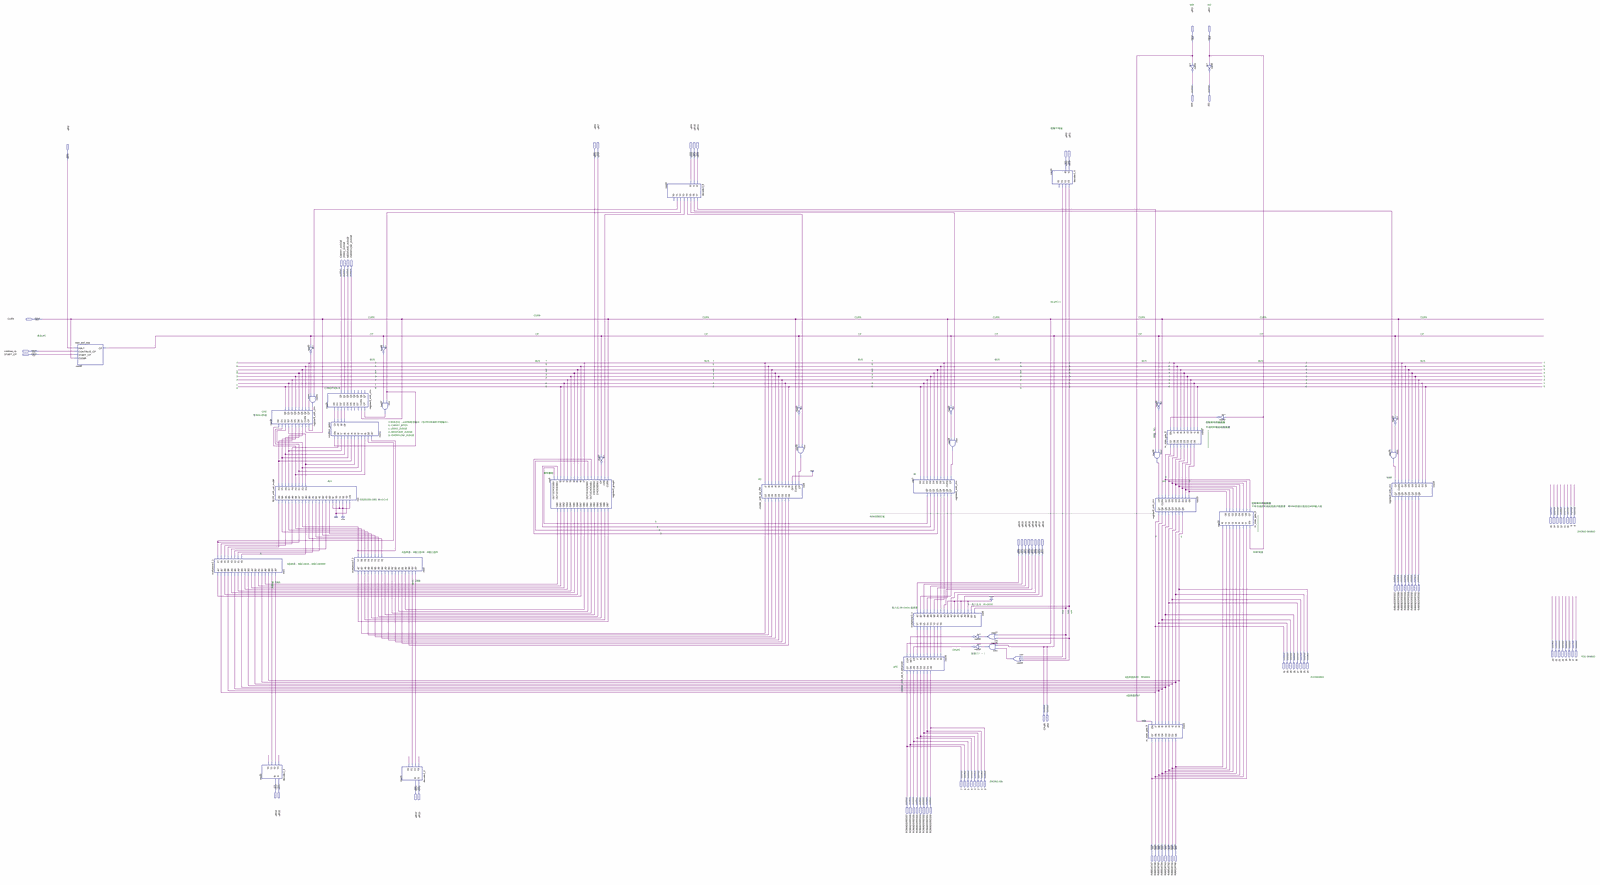
[diagram p0: schematic sheet, whole]
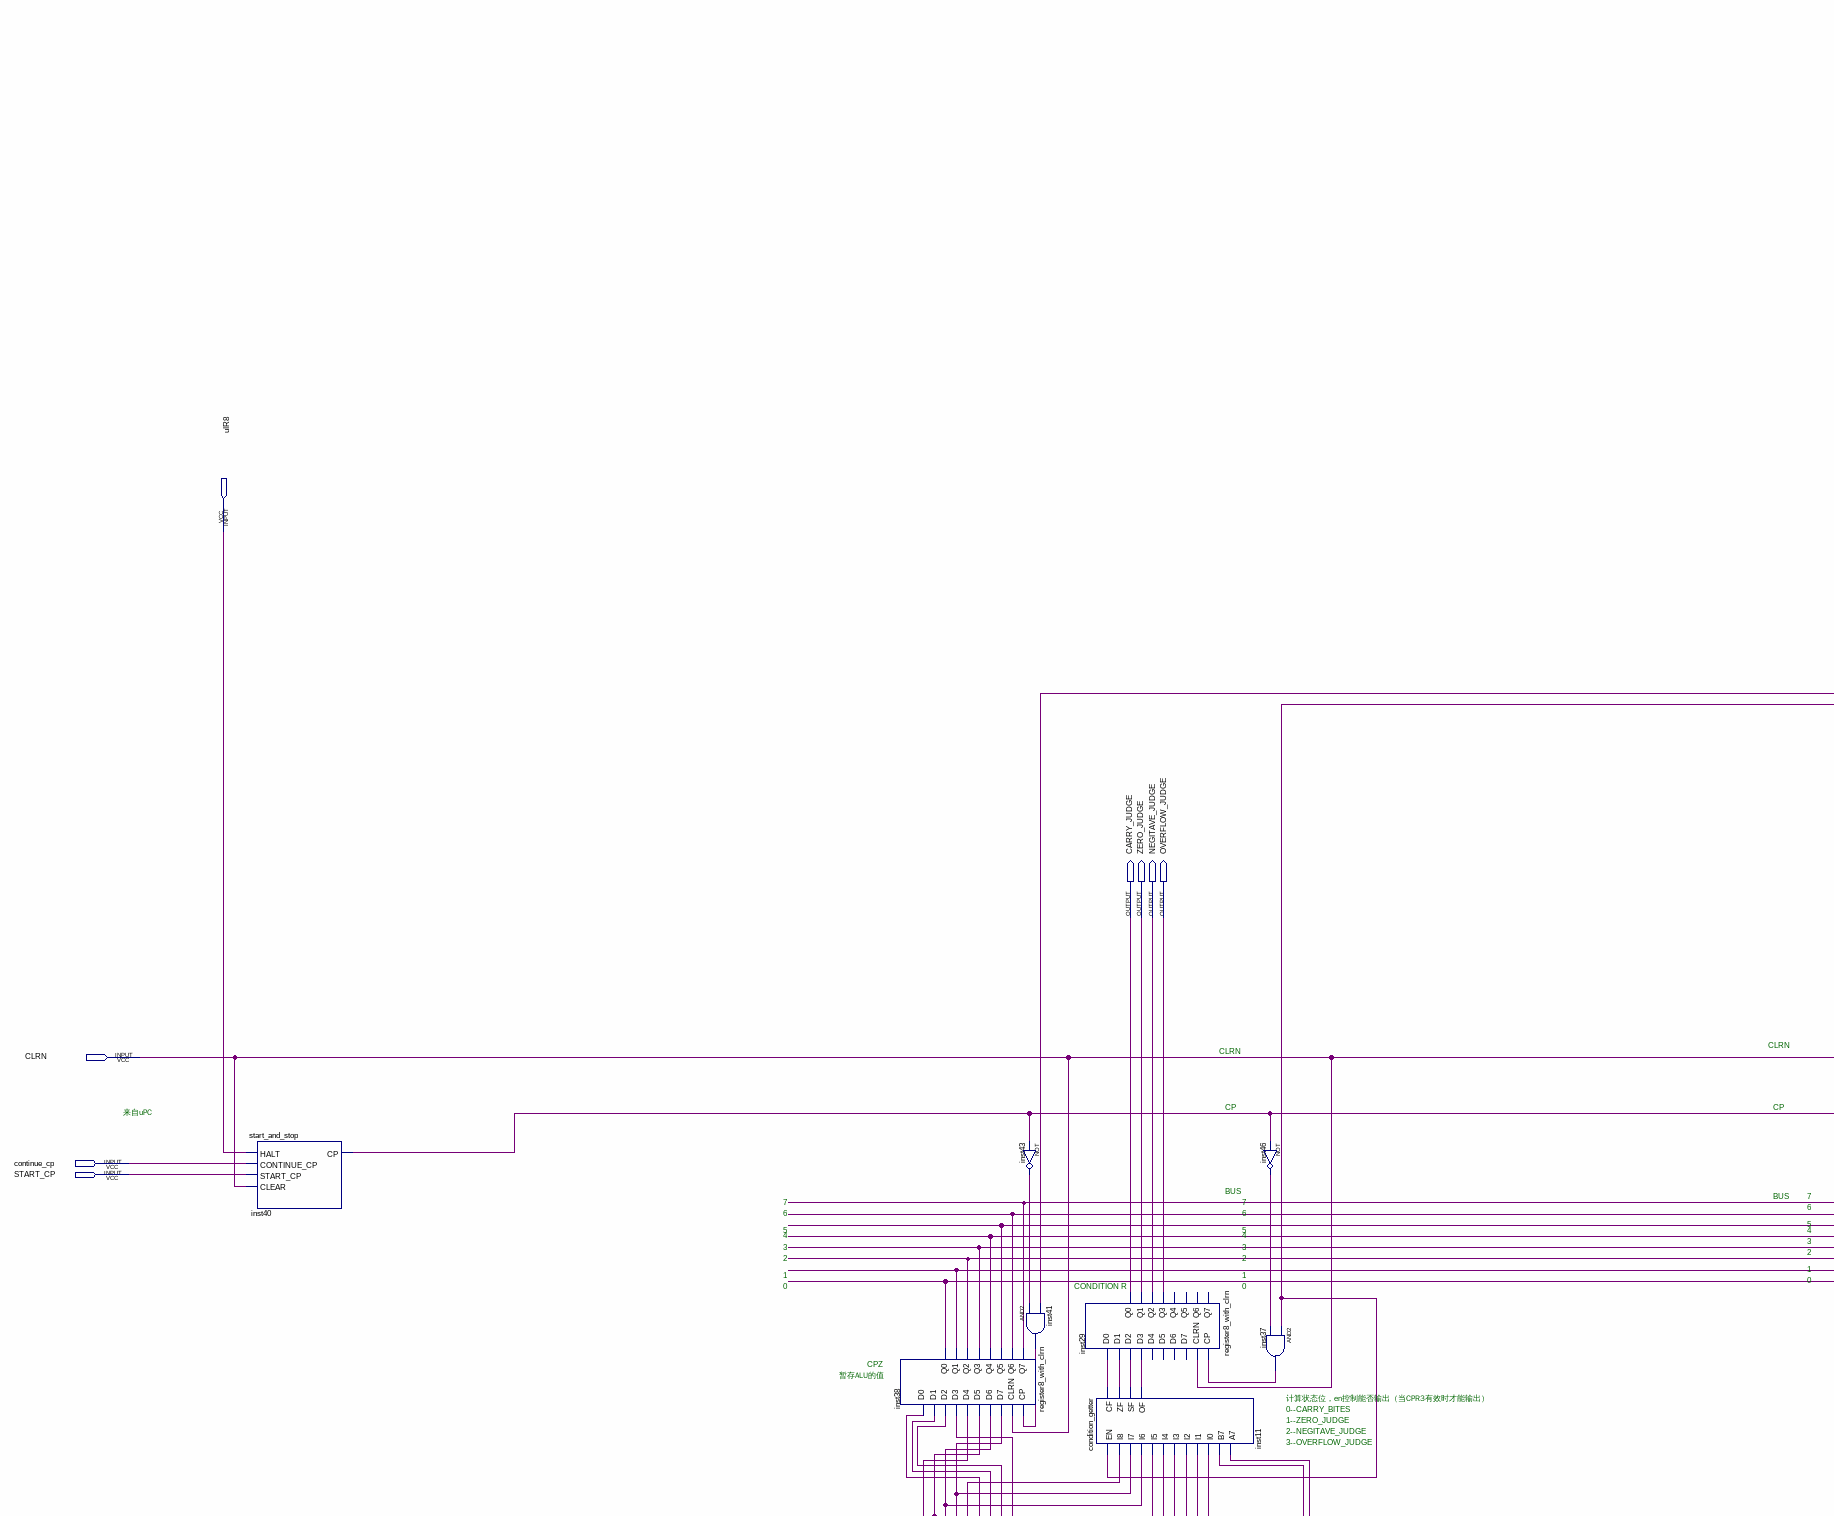
[diagram p1: schematic sheet, upper left part]
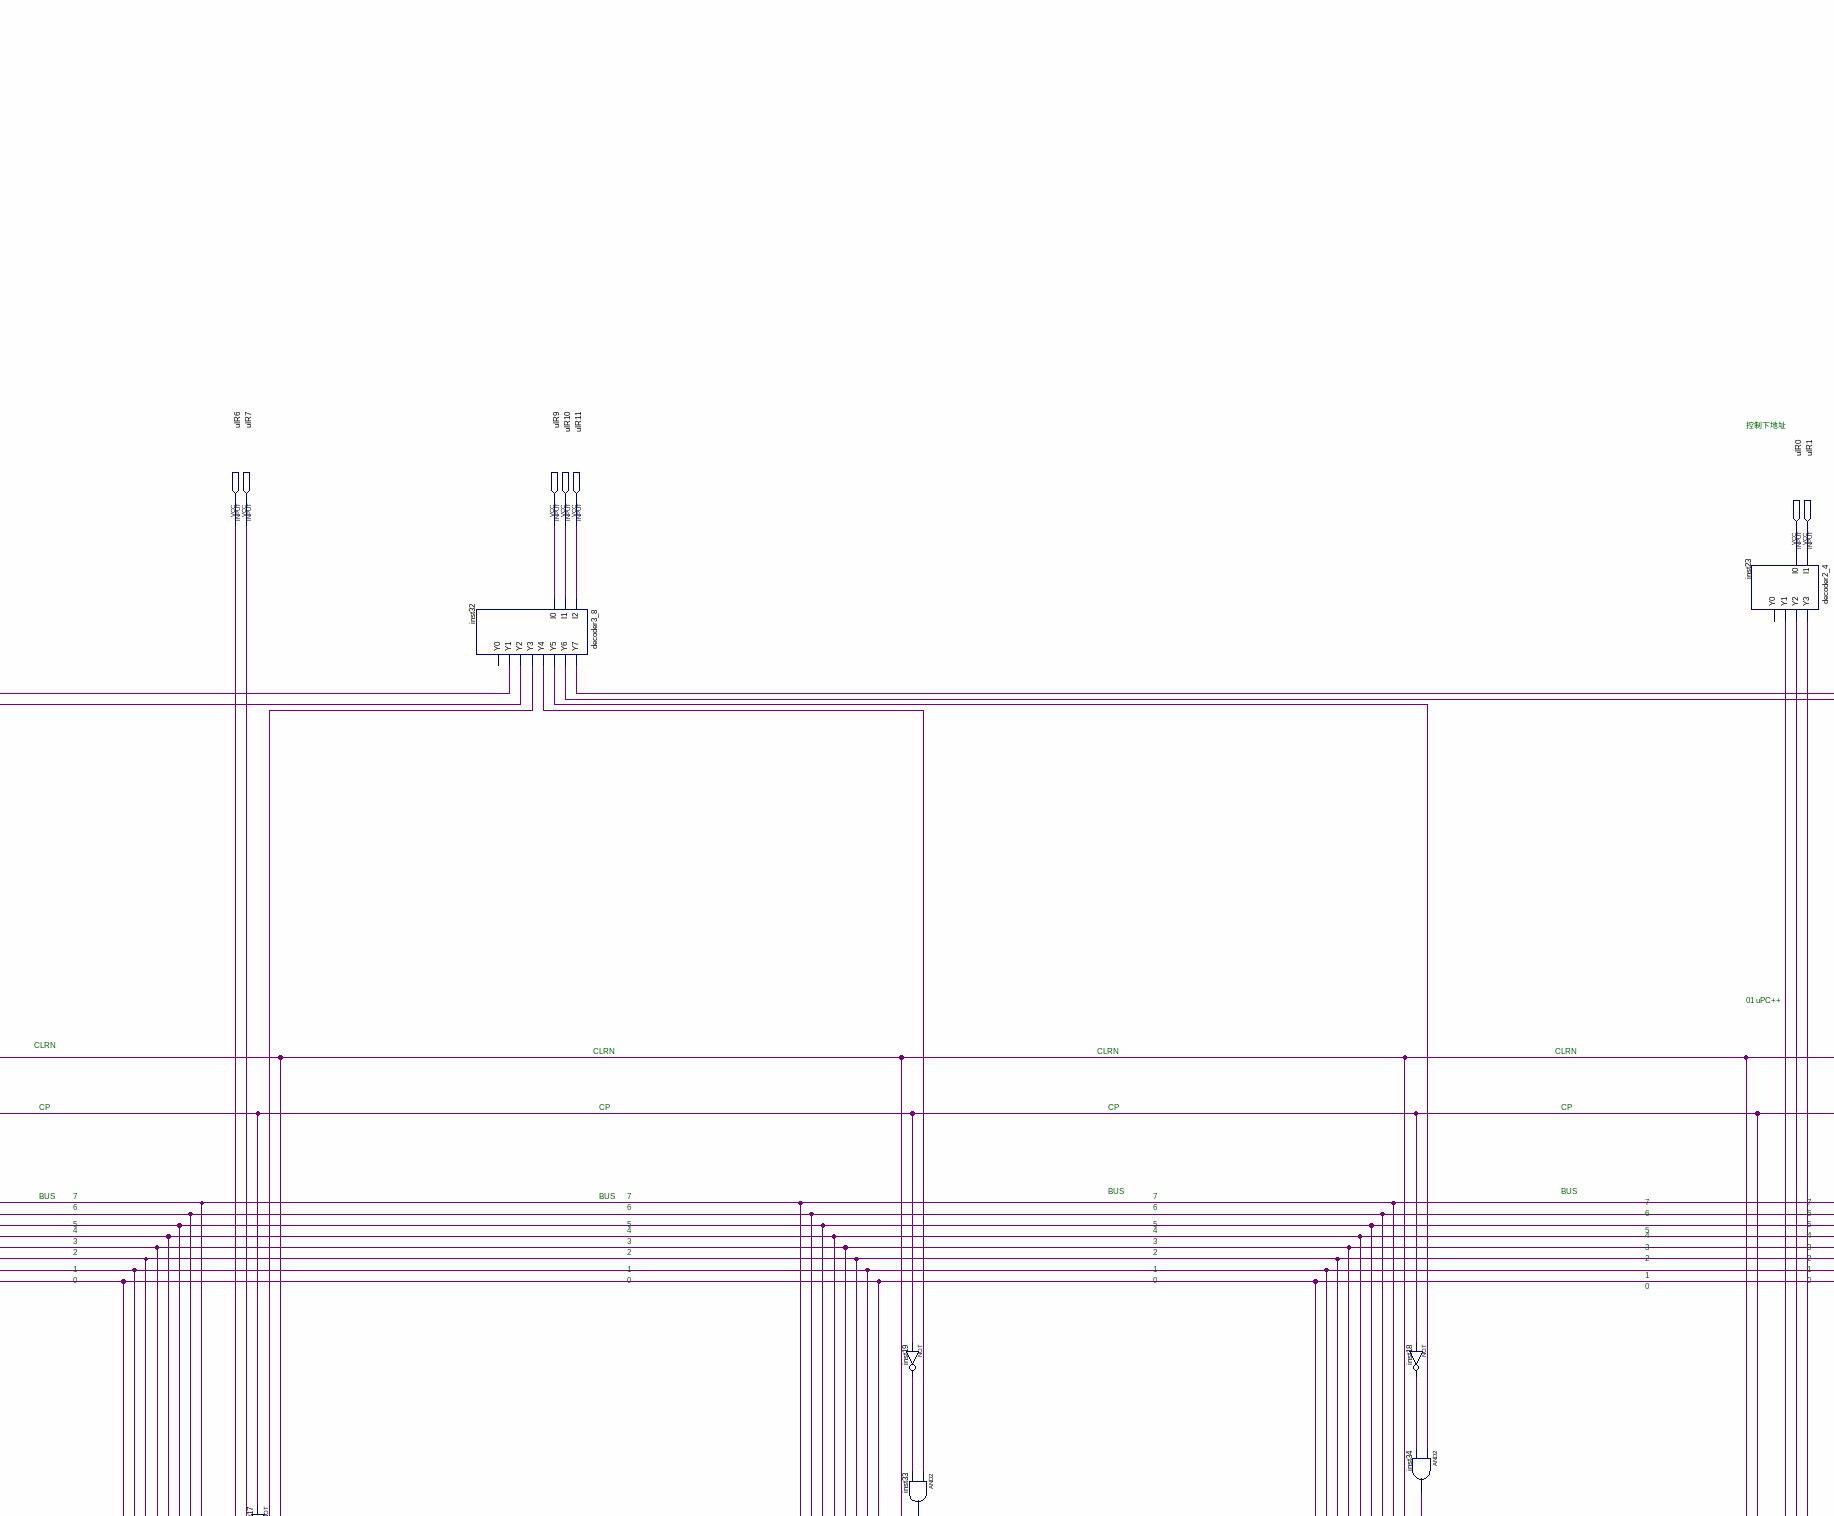
[diagram p2: schematic sheet, upper centre part]
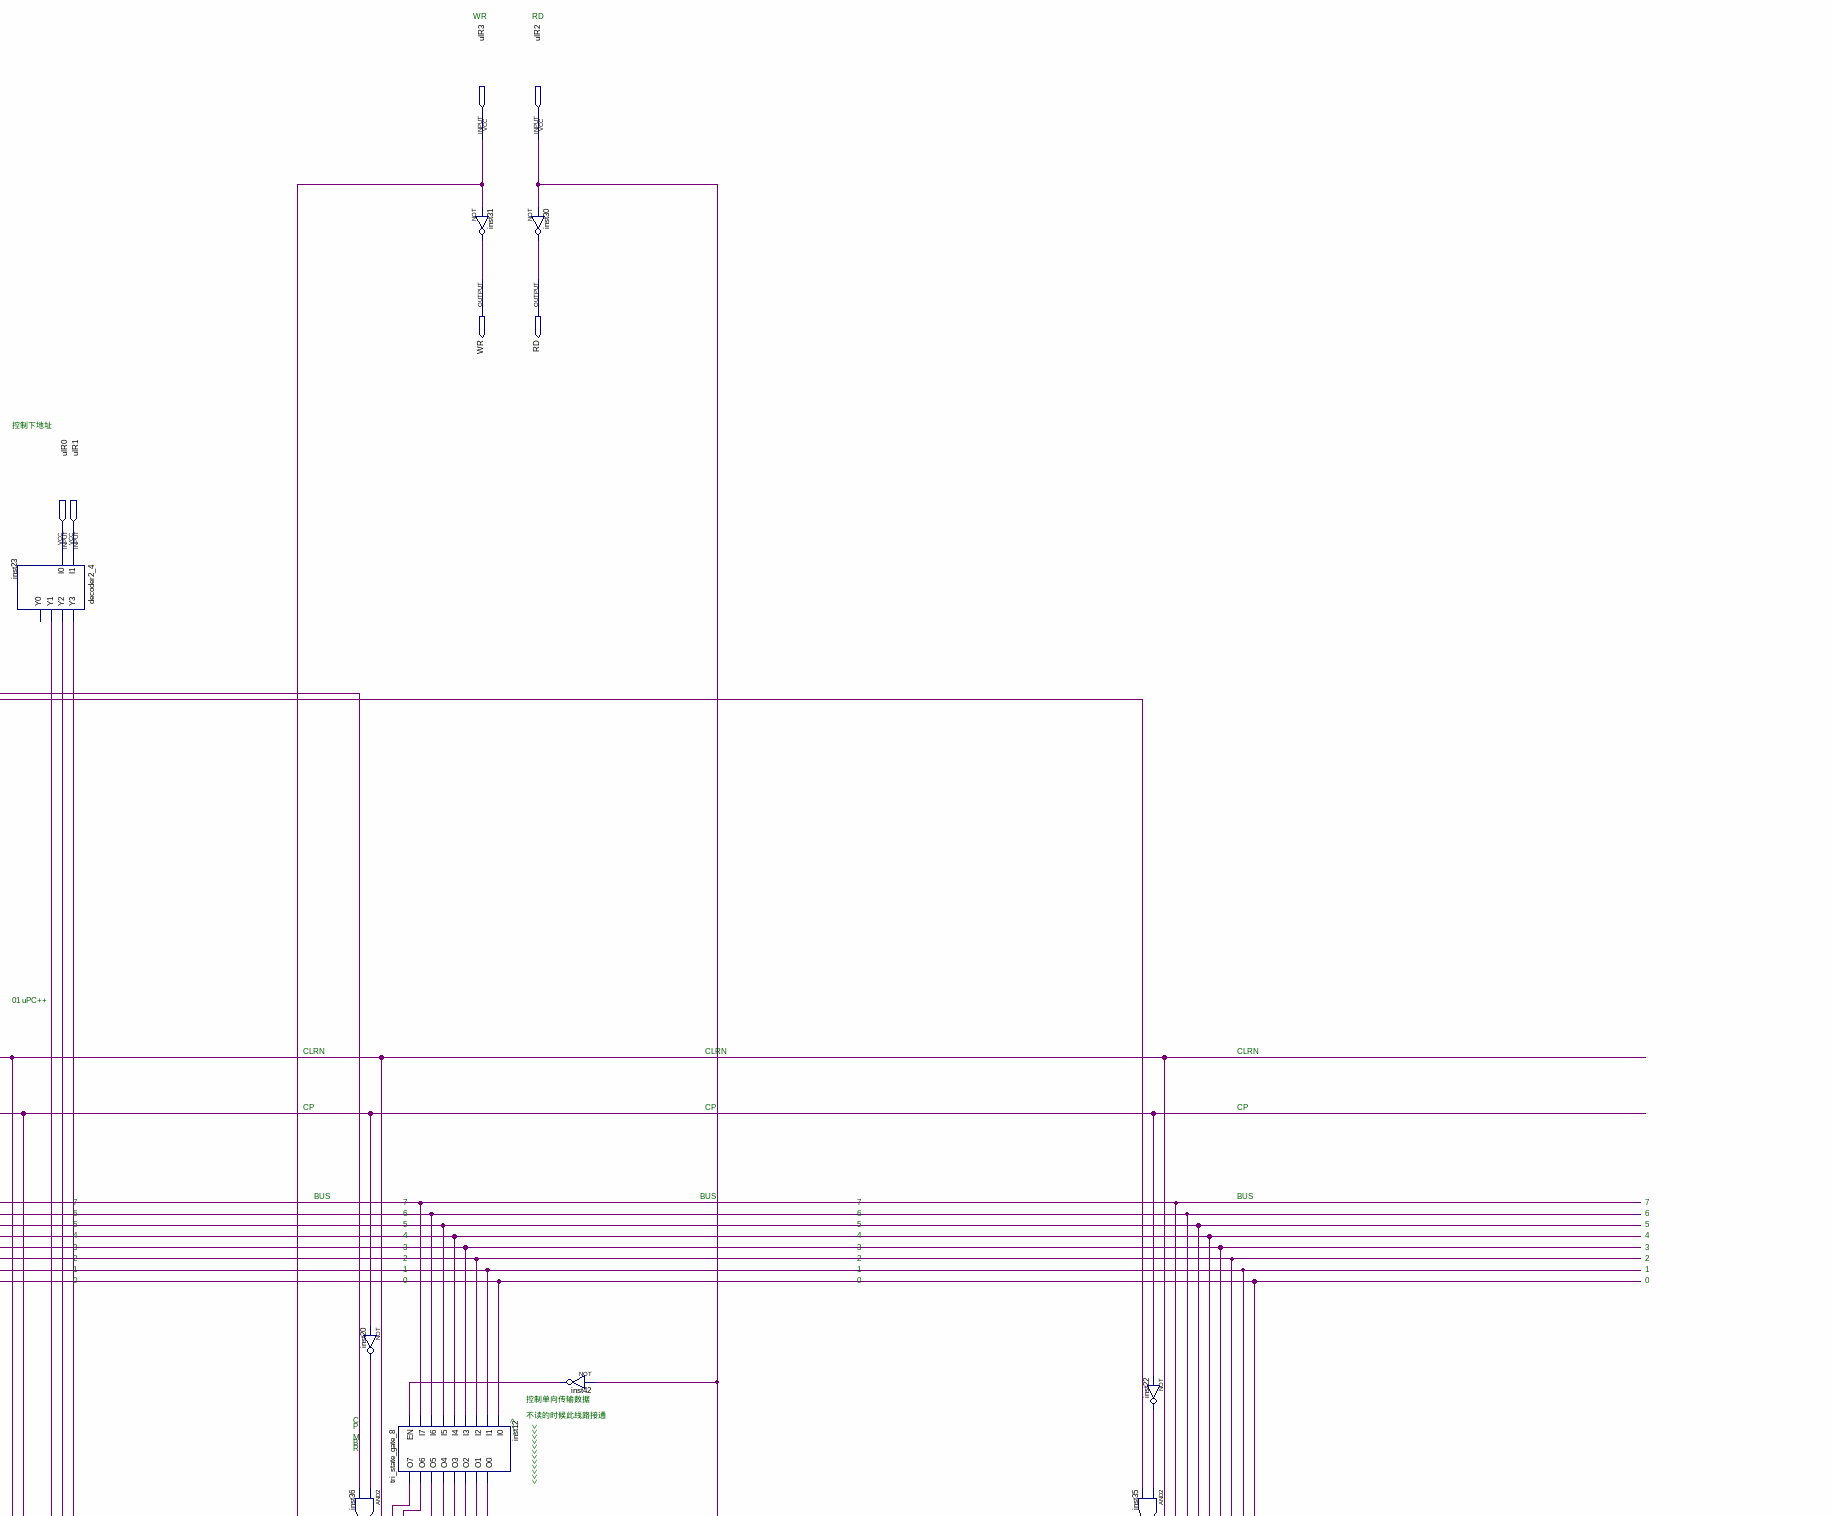
[diagram p3: schematic sheet, upper right part]
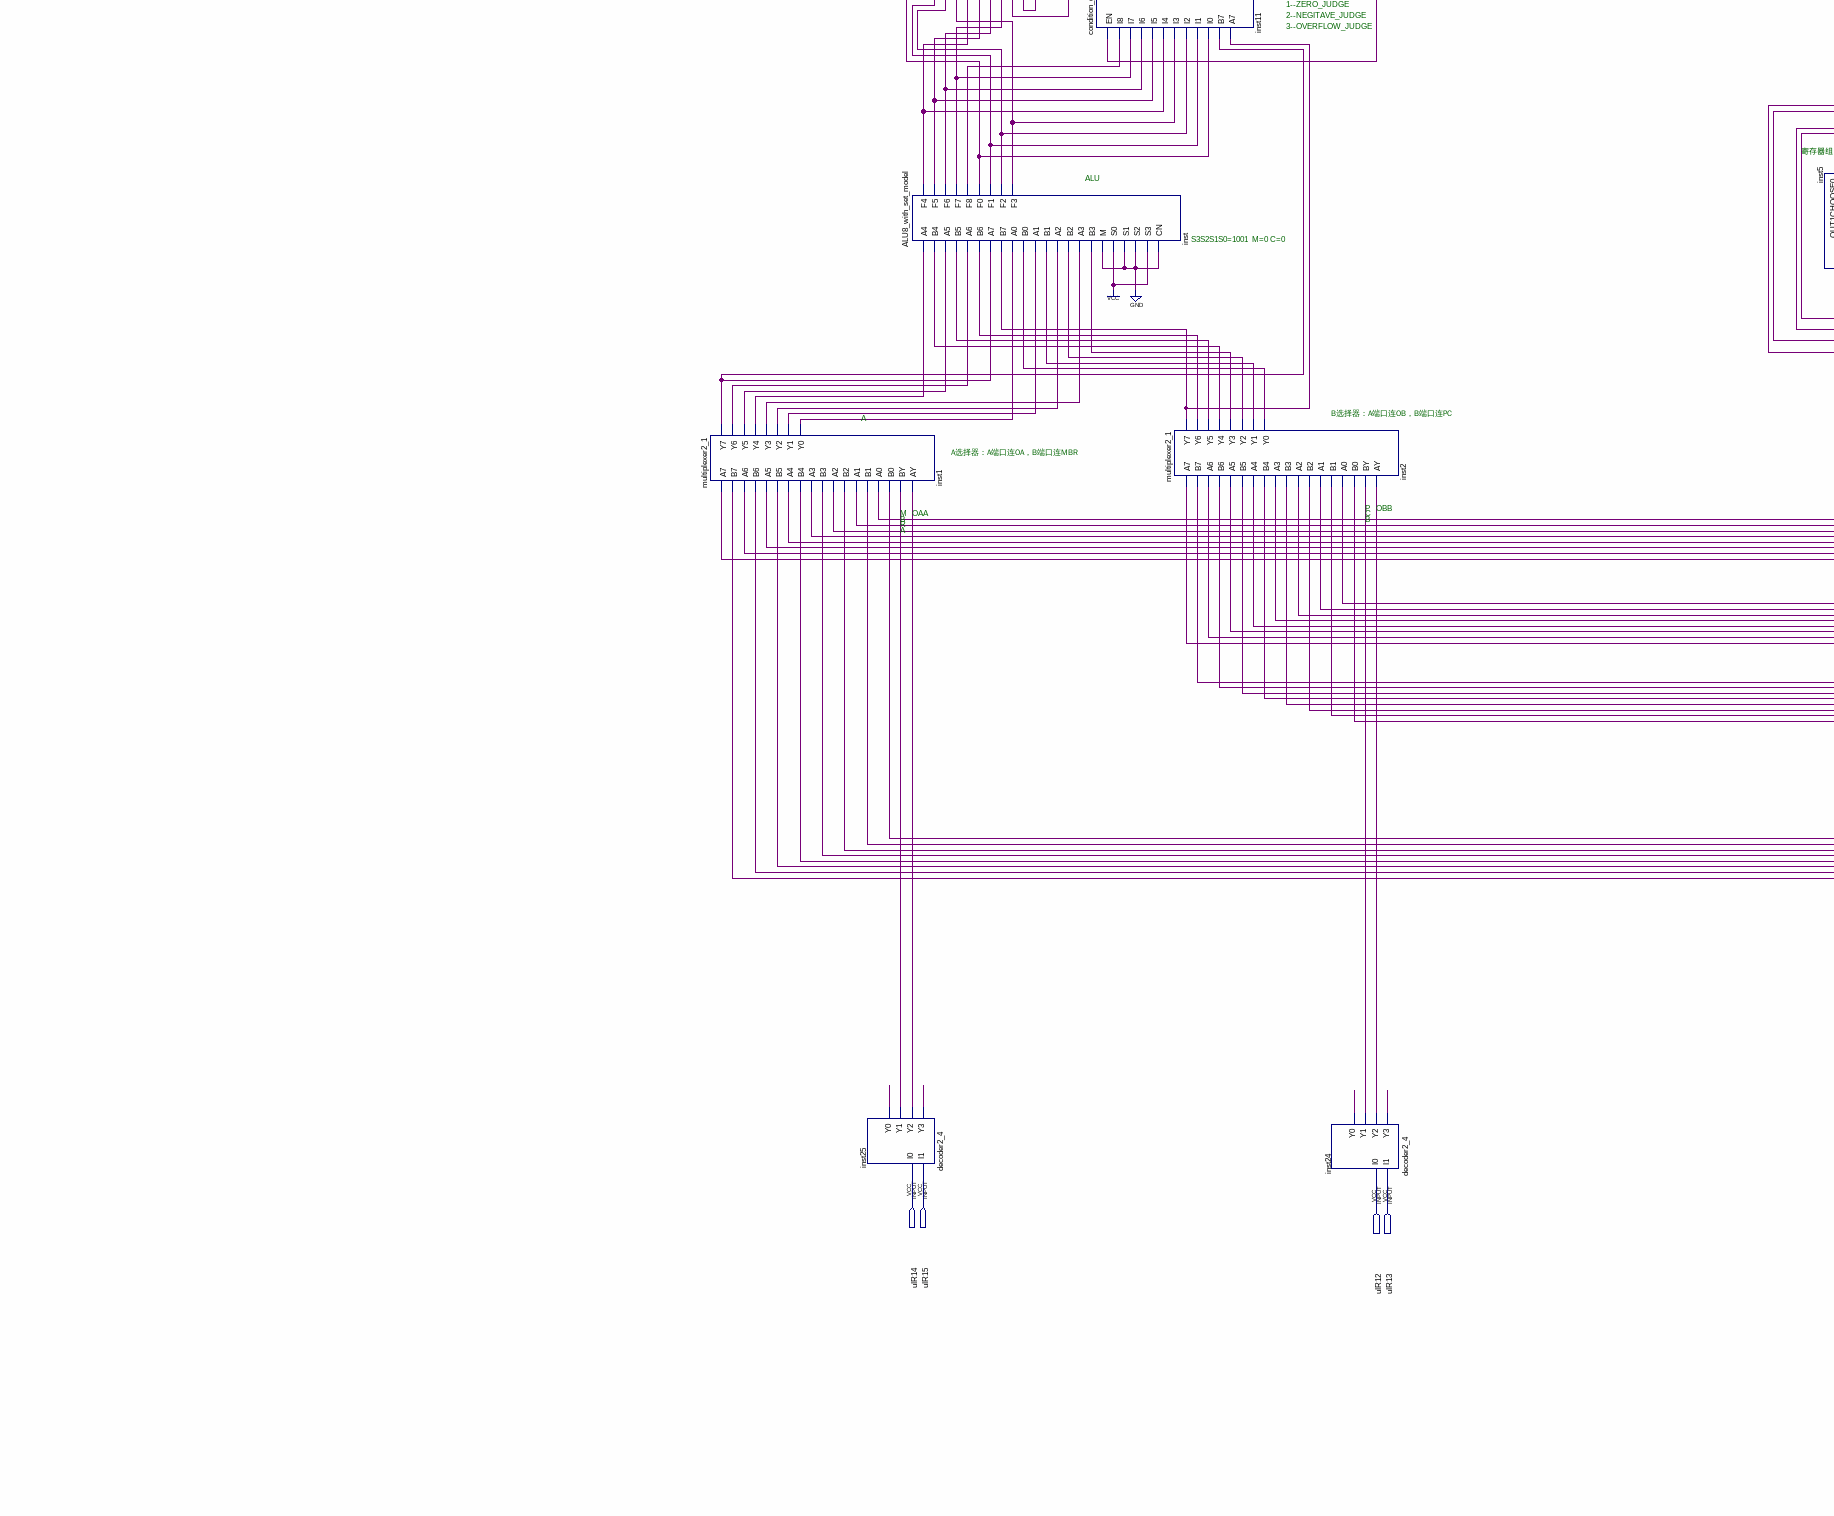
[diagram p4: schematic sheet, lower left part]
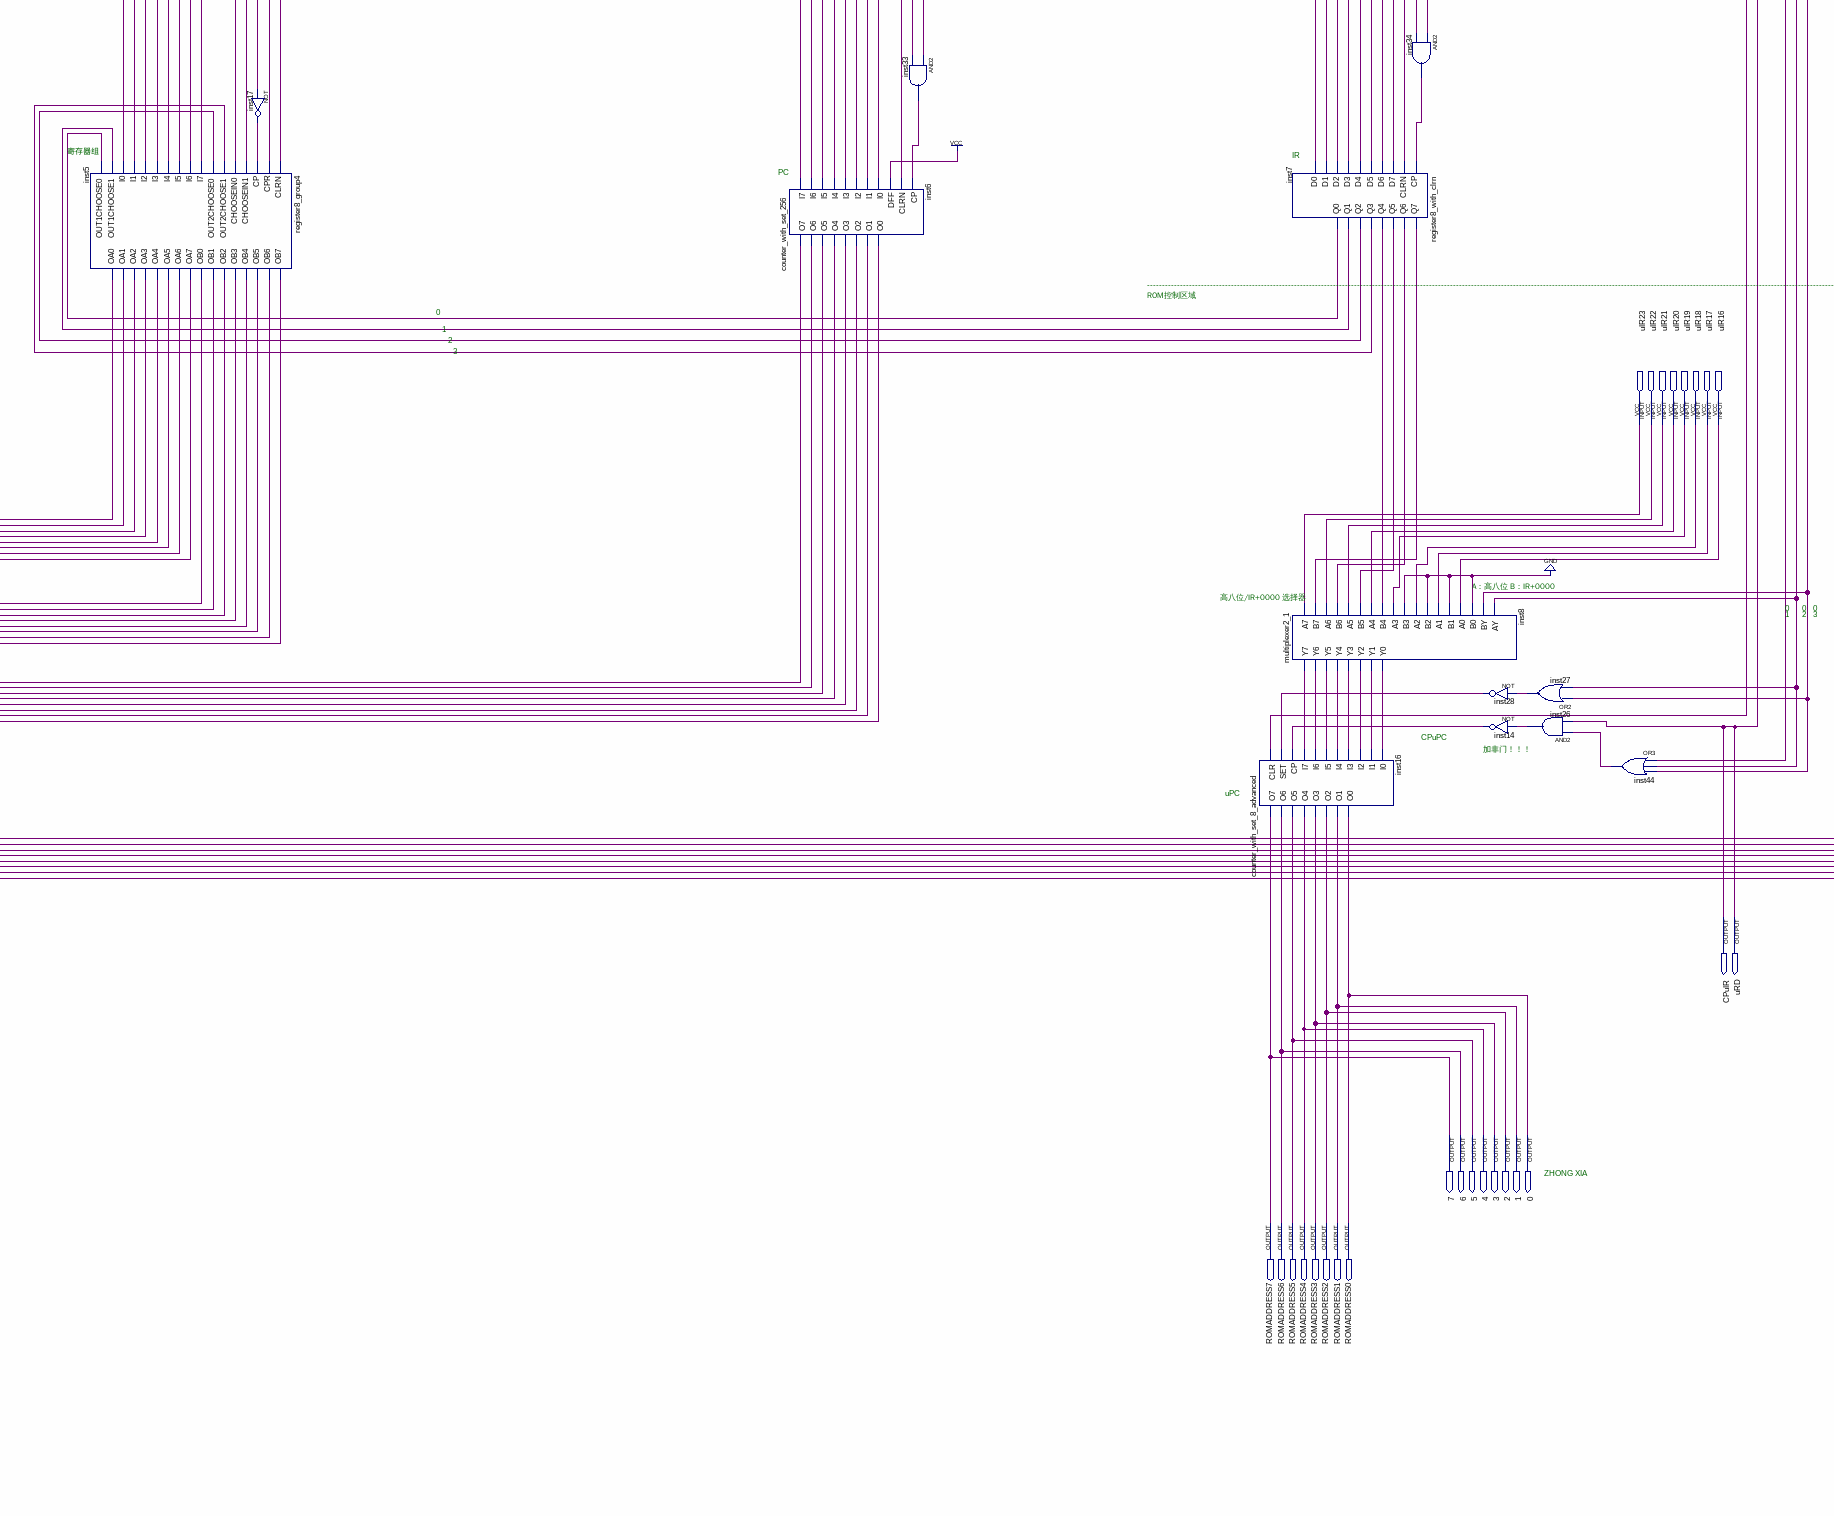
[diagram p5: schematic sheet, lower centre part]
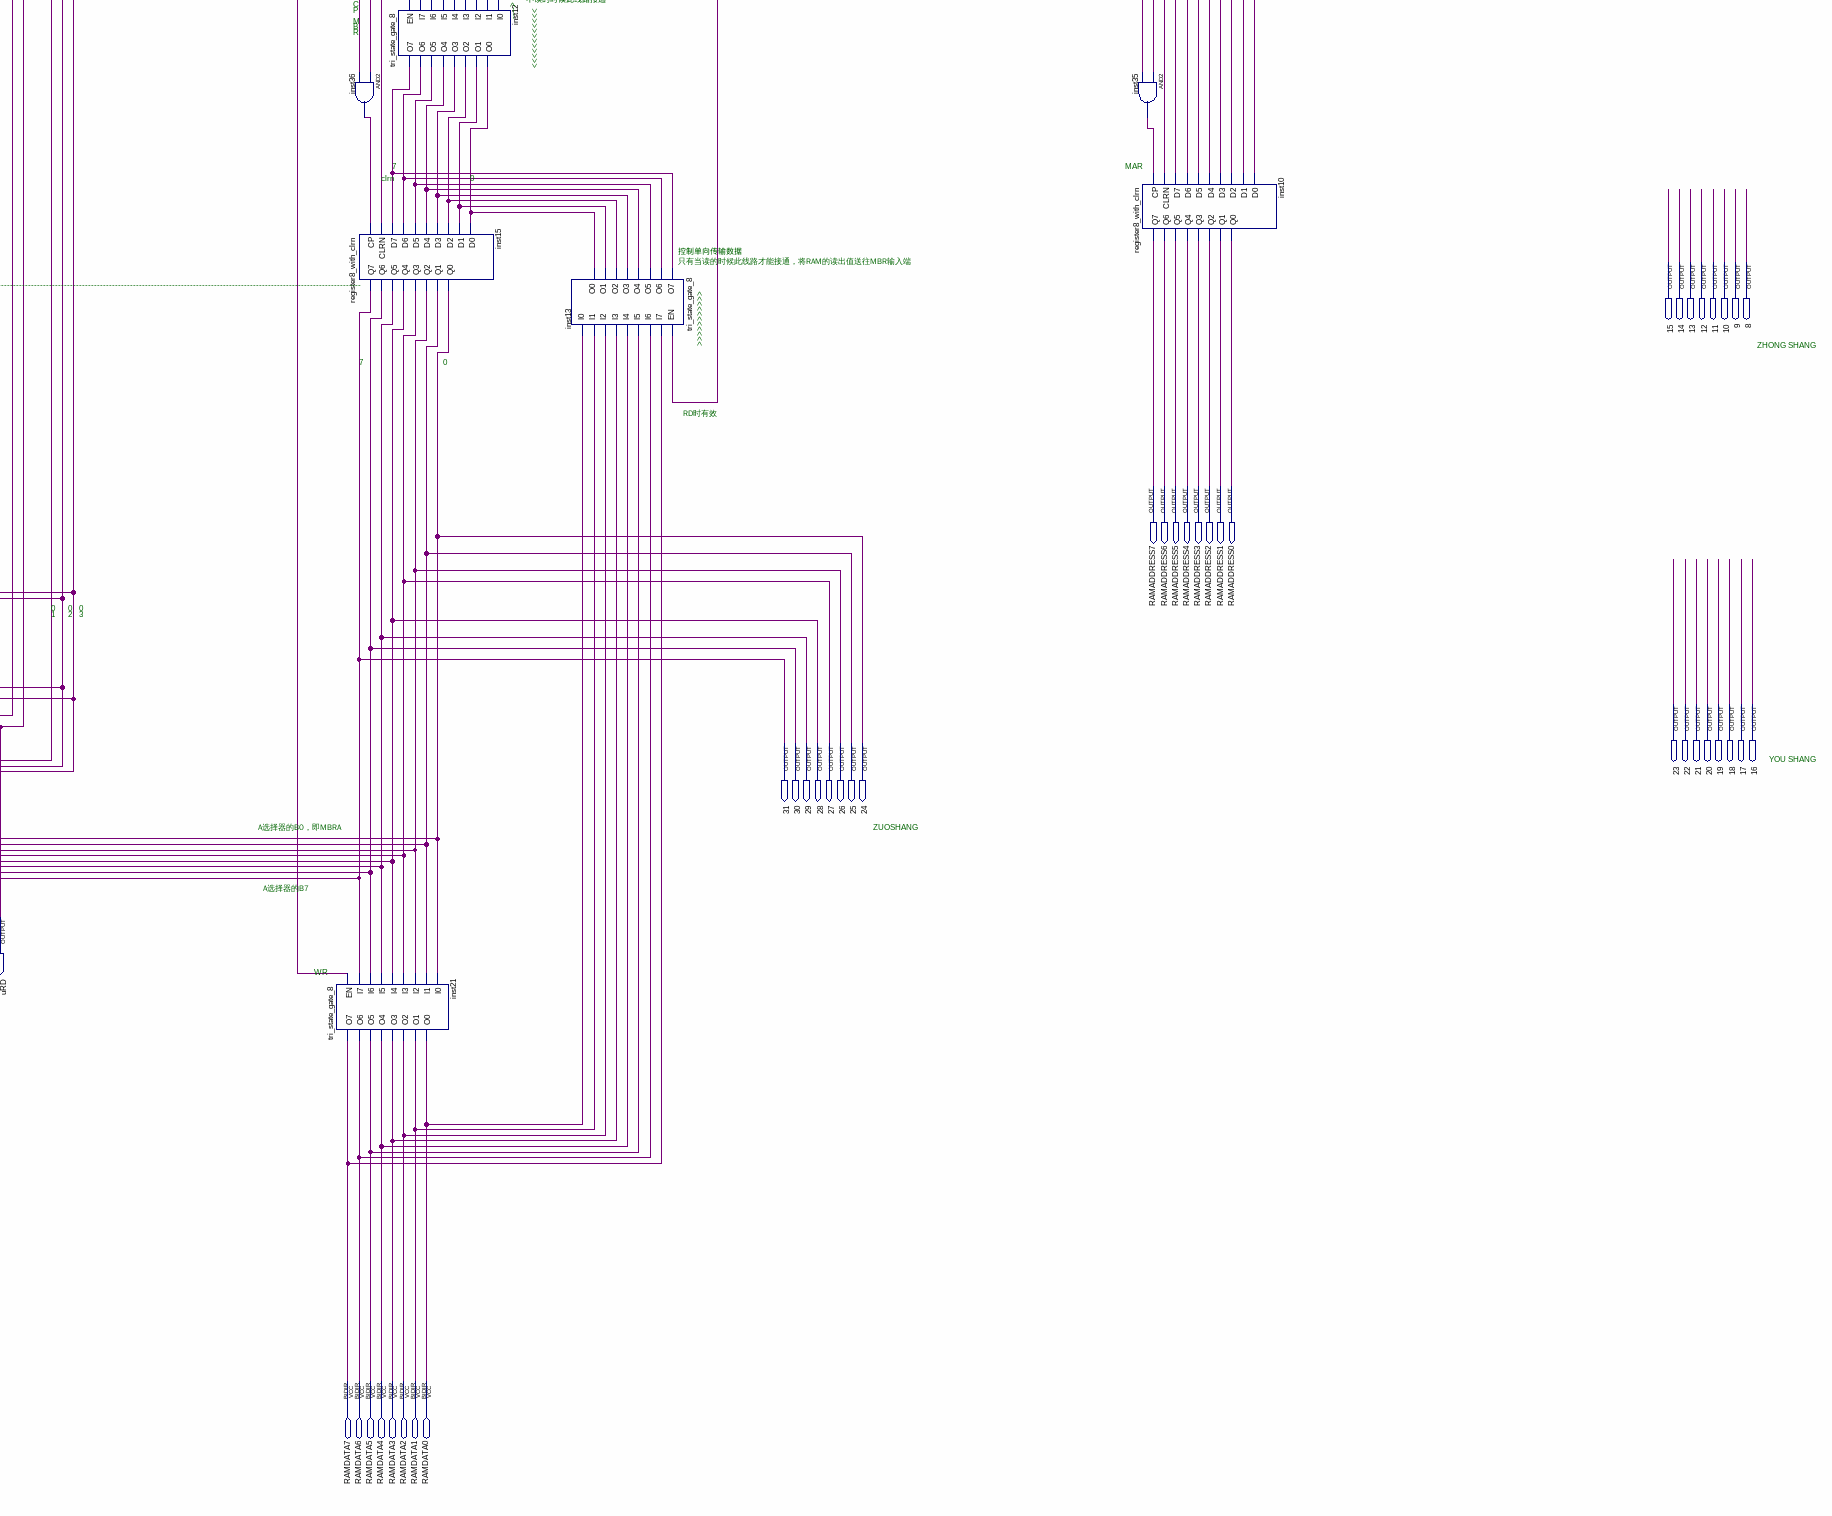
[diagram p6: schematic sheet, lower right part]
// Quartus schematic model_machine.bdf as structural Verilog: 42 symbols, 89 pins
module model_machine (
  input  uIR3,
  input  uIR2,
  input  uIR6,
  input  uIR7,
  input  uIR9,
  input  uIR10,
  input  uIR11,
  input  uIR8,
  input  uIR0,
  input  uIR1,
  input  CLRN,
  input  continue_cp,
  input  START_CP,
  input  uIR23,
  input  uIR22,
  input  uIR21,
  input  uIR20,
  input  uIR19,
  input  uIR18,
  input  uIR17,
  input  uIR16,
  input  uIR14,
  input  uIR15,
  input  uIR12,
  input  uIR13,
  inout  RAMDATA7,
  inout  RAMDATA6,
  inout  RAMDATA5,
  inout  RAMDATA4,
  inout  RAMDATA3,
  inout  RAMDATA2,
  inout  RAMDATA1,
  inout  RAMDATA0,
  output WR,
  output RD,
  output CARRY_JUDGE,
  output ZERO_JUDGE,
  output NEGITAVE_JUDGE,
  output OVERFLOW_JUDGE,
  output \15 ,
  output \14 ,
  output \13 ,
  output \12 ,
  output \11 ,
  output \10 ,
  output \9 ,
  output \8 ,
  output RAMADDRESS7,
  output RAMADDRESS6,
  output RAMADDRESS5,
  output RAMADDRESS4,
  output RAMADDRESS3,
  output RAMADDRESS2,
  output RAMADDRESS1,
  output RAMADDRESS0,
  output \23 ,
  output \22 ,
  output \21 ,
  output \20 ,
  output \19 ,
  output \18 ,
  output \17 ,
  output \16 ,
  output \31 ,
  output \30 ,
  output \29 ,
  output \28 ,
  output \27 ,
  output \26 ,
  output \25 ,
  output \24 ,
  output CPuIR,
  output uRD,
  output \7 ,
  output \6 ,
  output \5 ,
  output \4 ,
  output \3 ,
  output \2 ,
  output \1 ,
  output \0 ,
  output ROMADDRESS7,
  output ROMADDRESS6,
  output ROMADDRESS5,
  output ROMADDRESS4,
  output ROMADDRESS3,
  output ROMADDRESS2,
  output ROMADDRESS1,
  output ROMADDRESS0
);

  wire inst1_y0, inst1_y1, inst1_y2, inst1_y3, inst1_y4, inst1_y5, inst1_y6, inst1_y7, inst2_y0, inst2_y1,
       inst2_y2, inst2_y3, inst2_y4, inst2_y5, inst2_y6, inst2_y7, inst5_oa0, inst5_oa1, inst5_oa2,
       inst5_oa3, inst5_oa4, inst5_oa5, inst5_oa6, inst5_oa7, inst5_ob0, inst5_ob1, inst5_ob2, inst5_ob3,
       inst5_ob4, inst5_ob5, inst5_ob6, inst5_ob7, inst6_o0, inst6_o1, inst6_o2, inst6_o3, inst6_o4,
       inst6_o5, inst6_o6, inst6_o7, inst7_q0, inst7_q1, inst7_q2, inst7_q3, inst7_q4, inst7_q5, inst7_q6,
       inst7_q7, inst8_y0, inst8_y1, inst8_y2, inst8_y3, inst8_y4, inst8_y5, inst8_y6, inst8_y7, inst11_cf,
       inst11_of, inst11_sf, inst11_zf, inst12_o0, inst12_o1, inst12_o2, inst12_o3, inst12_o4, inst12_o5,
       inst12_o6, inst12_o7, inst14_out, inst17_out, inst18_out, inst19_out, inst20_out, inst22_out,
       inst23_y1, inst23_y2, inst23_y3, inst24_y0, inst24_y1, inst24_y2, inst24_y3, inst25_y0, inst25_y1,
       inst25_y2, inst25_y3, inst26_out, inst27_out, inst28_out, inst32_y1, inst32_y2, inst32_y3, inst32_y4,
       inst32_y5, inst32_y6, inst32_y7, inst33_out, inst34_out, inst35_out, inst36_out, inst37_out,
       inst38_q0, inst38_q1, inst38_q2, inst38_q3, inst38_q4, inst38_q5, inst38_q6, inst38_q7, inst41_out,
       inst42_out, inst43_out, inst44_out, inst46_out, inst_f0, inst_f1, inst_f2, inst_f3, inst_f4, inst_f5,
       inst_f6, inst_f7, inst_f8;

  start_and_stop inst40 (.HALT(uIR8), .CONTINUE_CP(continue_cp), .START_CP(START_CP), .CLEAR(CLRN), .CP(CPuIR));
  multiplexer2_1 inst1 (
    .A7(inst5_oa7), .B7(\31 ), .A6(inst5_oa6), .B6(\30 ), .A5(inst5_oa5), .B5(\29 ), .A4(inst5_oa4),
    .B4(\28 ), .A3(inst5_oa3), .B3(\27 ), .A2(inst5_oa2), .B2(\26 ), .A1(inst5_oa1), .B1(\25 ),
    .A0(inst5_oa0), .B0(\24 ), .BY(inst25_y1), .AY(inst25_y2), .Y7(inst1_y7), .Y6(inst1_y6), .Y5(inst1_y5),
    .Y4(inst1_y4), .Y3(inst1_y3), .Y2(inst1_y2), .Y1(inst1_y1), .Y0(inst1_y0));
  decoder2_4 inst25 (.I1(uIR15), .I0(uIR14), .Y3(inst25_y3), .Y2(inst25_y2), .Y1(inst25_y1), .Y0(inst25_y0));
  register8_with_clrn inst38 (
    .CP(inst41_out), .CLRN(CLRN), .D7(inst_f7), .D6(inst_f6), .D5(inst_f5), .D4(inst_f4), .D3(inst_f3),
    .D2(inst_f2), .D1(inst_f1), .D0(inst_f0), .Q7(inst38_q7), .Q6(inst38_q6), .Q5(inst38_q5), .Q4(inst38_q4),
    .Q3(inst38_q3), .Q2(inst38_q2), .Q1(inst38_q1), .Q0(inst38_q0));
  ALU8_with_set_model inst (
    .A4(inst1_y4), .B4(inst2_y4), .A5(inst1_y5), .B5(inst2_y5), .A6(inst1_y6), .B6(inst2_y6), .A7(inst1_y7),
    .B7(inst2_y7), .A0(inst1_y0), .B0(inst2_y0), .A1(inst1_y1), .B1(inst2_y1), .A2(inst1_y2), .B2(inst2_y2),
    .A3(inst1_y3), .B3(inst2_y3), .M(1'b0), .S0(1'b1), .S1(1'b0), .S2(1'b0), .S3(1'b1), .CN(1'b0),
    .F4(inst_f4), .F5(inst_f5), .F6(inst_f6), .F7(inst_f7), .F8(inst_f8), .F0(inst_f0), .F1(inst_f1),
    .F2(inst_f2), .F3(inst_f3));
  not inst43 (inst43_out, CPuIR);
  and inst41 (inst41_out, inst43_out, inst32_y1);
  register8_with_clrn inst29 (
    .CP(inst37_out), .CLRN(CLRN), .D3(inst11_of), .D2(inst11_sf), .D1(inst11_zf), .D0(inst11_cf),
    .Q3(OVERFLOW_JUDGE), .Q2(NEGITAVE_JUDGE), .Q1(ZERO_JUDGE), .Q0(CARRY_JUDGE));  // open: D7, D6, D5, D4, Q7, Q6, Q5, Q4
  condition_getter inst11 (
    .EN(inst32_y2), .I8(inst_f8), .I7(inst_f7), .I6(inst_f6), .I5(inst_f5), .I4(inst_f4), .I3(inst_f3),
    .I2(inst_f2), .I1(inst_f1), .I0(inst_f0), .B7(inst1_y7), .A7(inst2_y7), .CF(inst11_cf), .ZF(inst11_zf),
    .SF(inst11_sf), .OF(inst11_of));
  multiplexer2_1 inst2 (
    .A7(inst5_ob7), .B7(inst6_o7), .A6(inst5_ob6), .B6(inst6_o6), .A5(inst5_ob5), .B5(inst6_o5),
    .A4(inst5_ob4), .B4(inst6_o4), .A3(inst5_ob3), .B3(inst6_o3), .A2(inst5_ob2), .B2(inst6_o2),
    .A1(inst5_ob1), .B1(inst6_o1), .A0(inst5_ob0), .B0(inst6_o0), .BY(inst24_y1), .AY(inst24_y2),
    .Y7(inst2_y7), .Y6(inst2_y6), .Y5(inst2_y5), .Y4(inst2_y4), .Y3(inst2_y3), .Y2(inst2_y2), .Y1(inst2_y1),
    .Y0(inst2_y0));
  not inst46 (inst46_out, CPuIR);
  and inst37 (inst37_out, inst32_y2, inst46_out);
  decoder2_4 inst24 (.I1(uIR13), .I0(uIR12), .Y3(inst24_y3), .Y2(inst24_y2), .Y1(inst24_y1), .Y0(inst24_y0));
  register8_group4 inst5 (
    .CLRN(CLRN), .CPR(inst32_y3), .CP(inst17_out), .CHOOSEIN1(uIR7), .CHOOSEIN0(uIR6),
    .OUT2CHOOSE1(inst7_q3), .OUT2CHOOSE0(inst7_q2), .I7(inst38_q7), .I6(inst38_q6), .I5(inst38_q5),
    .I4(inst38_q4), .I3(inst38_q3), .I2(inst38_q2), .I1(inst38_q1), .I0(inst38_q0), .OUT1CHOOSE1(inst7_q1),
    .OUT1CHOOSE0(inst7_q0), .OB7(inst5_ob7), .OB6(inst5_ob6), .OB5(inst5_ob5), .OB4(inst5_ob4),
    .OB3(inst5_ob3), .OB2(inst5_ob2), .OB1(inst5_ob1), .OB0(inst5_ob0), .OA7(inst5_oa7), .OA6(inst5_oa6),
    .OA5(inst5_oa5), .OA4(inst5_oa4), .OA3(inst5_oa3), .OA2(inst5_oa2), .OA1(inst5_oa1), .OA0(inst5_oa0));
  not inst17 (inst17_out, CPuIR);
  decoder3_8 inst32 (
    .I2(uIR11), .I1(uIR10), .I0(uIR9), .Y7(inst32_y7), .Y6(inst32_y6), .Y5(inst32_y5), .Y4(inst32_y4),
    .Y3(inst32_y3), .Y2(inst32_y2), .Y1(inst32_y1));  // open: Y0
  counter_with_set_256 inst6 (
    .I7(inst38_q7), .I6(inst38_q6), .I5(inst38_q5), .I4(inst38_q4), .I3(inst38_q3), .I2(inst38_q2),
    .I1(inst38_q1), .I0(inst38_q0), .DFF(1'b1), .CLRN(CLRN), .CP(inst33_out), .O7(inst6_o7), .O6(inst6_o6),
    .O5(inst6_o5), .O4(inst6_o4), .O3(inst6_o3), .O2(inst6_o2), .O1(inst6_o1), .O0(inst6_o0));
  not inst19 (inst19_out, CPuIR);
  and inst33 (inst33_out, inst32_y4, inst19_out);
  counter_with_set_8_advanced inst16 (
    .CLR(CLRN), .SET(inst28_out), .CP(inst14_out), .I7(inst8_y7), .I6(inst8_y6), .I5(inst8_y5),
    .I4(inst8_y4), .I3(inst8_y3), .I2(inst8_y2), .I1(inst8_y1), .I0(inst8_y0), .O7(\7 ), .O6(\6 ), .O5(\5 ),
    .O4(\4 ), .O3(\3 ), .O2(\2 ), .O1(\1 ), .O0(\0 ));
  register8_with_clrn inst7 (
    .CP(inst34_out), .CLRN(CLRN), .D7(inst38_q7), .D6(inst38_q6), .D5(inst38_q5), .D4(inst38_q4),
    .D3(inst38_q3), .D2(inst38_q2), .D1(inst38_q1), .D0(inst38_q0), .Q7(inst7_q7), .Q6(inst7_q6),
    .Q5(inst7_q5), .Q4(inst7_q4), .Q3(inst7_q3), .Q2(inst7_q2), .Q1(inst7_q1), .Q0(inst7_q0));
  multiplexer2_1 inst8 (
    .A7(uIR23), .B7(inst7_q7), .A6(uIR22), .B6(inst7_q6), .A5(uIR21), .B5(inst7_q5), .A4(uIR20),
    .B4(inst7_q4), .A3(uIR19), .B3(1'b0), .A2(uIR18), .B2(1'b0), .A1(uIR17), .B1(1'b0), .A0(uIR16),
    .B0(1'b0), .BY(inst23_y3), .AY(inst23_y2), .Y7(inst8_y7), .Y6(inst8_y6), .Y5(inst8_y5), .Y4(inst8_y4),
    .Y3(inst8_y3), .Y2(inst8_y2), .Y1(inst8_y1), .Y0(inst8_y0));
  not inst18 (inst18_out, CPuIR);
  and inst34 (inst34_out, inst32_y5, inst18_out);
  not inst28 (inst28_out, inst27_out);
  not inst14 (inst14_out, inst26_out);
  or inst27 (inst27_out, inst23_y3, inst23_y2);
  and inst26 (inst26_out, inst44_out, CPuIR);
  or inst44 (inst44_out, inst23_y1, inst23_y2, inst23_y3);
  decoder2_4 inst23 (.I1(uIR1), .I0(uIR0), .Y3(inst23_y3), .Y2(inst23_y2), .Y1(inst23_y1));  // open: Y0
  not inst20 (inst20_out, CPuIR);
  and inst36 (inst36_out, inst20_out, inst32_y7);
  register8_with_clrn inst15 (
    .CP(inst36_out), .CLRN(CLRN), .D7(inst12_o7), .D6(inst12_o6), .D5(inst12_o5), .D4(inst12_o4),
    .D3(inst12_o3), .D2(inst12_o2), .D1(inst12_o1), .D0(inst12_o0), .Q7(\31 ), .Q6(\30 ), .Q5(\29 ),
    .Q4(\28 ), .Q3(\27 ), .Q2(\26 ), .Q1(\25 ), .Q0(\24 ));
  tri_state_gate_8 inst21 (
    .EN(uIR3), .I7(\31 ), .I6(\30 ), .I5(\29 ), .I4(\28 ), .I3(\27 ), .I2(\26 ), .I1(\25 ), .I0(\24 ),
    .O7(RAMDATA7), .O6(RAMDATA6), .O5(RAMDATA5), .O4(RAMDATA4), .O3(RAMDATA3), .O2(RAMDATA2), .O1(RAMDATA1),
    .O0(RAMDATA0));
  tri_state_gate_8 inst12 (
    .EN(inst42_out), .I7(inst38_q7), .I6(inst38_q6), .I5(inst38_q5), .I4(inst38_q4), .I3(inst38_q3),
    .I2(inst38_q2), .I1(inst38_q1), .I0(inst38_q0), .O7(inst12_o7), .O6(inst12_o6), .O5(inst12_o5),
    .O4(inst12_o4), .O3(inst12_o3), .O2(inst12_o2), .O1(inst12_o1), .O0(inst12_o0));
  not inst31 (WR, uIR3);
  not inst30 (RD, uIR2);
  not inst42 (inst42_out, uIR2);
  tri_state_gate_8 inst13 (
    .EN(uIR2), .I7(RAMDATA7), .I6(RAMDATA6), .I5(RAMDATA5), .I4(RAMDATA4), .I3(RAMDATA3), .I2(RAMDATA2),
    .I1(RAMDATA1), .I0(RAMDATA0), .O7(inst12_o7), .O6(inst12_o6), .O5(inst12_o5), .O4(inst12_o4),
    .O3(inst12_o3), .O2(inst12_o2), .O1(inst12_o1), .O0(inst12_o0));
  not inst22 (inst22_out, CPuIR);
  and inst35 (inst35_out, inst22_out, inst32_y6);
  register8_with_clrn inst10 (
    .CP(inst35_out), .CLRN(CLRN), .D7(inst38_q7), .D6(inst38_q6), .D5(inst38_q5), .D4(inst38_q4),
    .D3(inst38_q3), .D2(inst38_q2), .D1(inst38_q1), .D0(inst38_q0), .Q7(RAMADDRESS7), .Q6(RAMADDRESS6),
    .Q5(RAMADDRESS5), .Q4(RAMADDRESS4), .Q3(RAMADDRESS3), .Q2(RAMADDRESS2), .Q1(RAMADDRESS1), .Q0(RAMADDRESS0));

  assign ROMADDRESS0 = \0 ;
  assign ROMADDRESS1 = \1 ;
  assign ROMADDRESS2 = \2 ;
  assign ROMADDRESS3 = \3 ;
  assign ROMADDRESS4 = \4 ;
  assign ROMADDRESS5 = \5 ;
  assign ROMADDRESS6 = \6 ;
  assign ROMADDRESS7 = \7 ;
  assign uRD = CPuIR;

  // Notes on the sheet:
  //   WR
  //   RD
  //   控制下地址
  //   01 uPC++
  //   CLRN
  //   CLRN
  //   CLRN
  //   CLRN
  //   CLRN
  //   CLRN
  //   CLRN
  //   CLRN
  //   CP
  //   CP
  //   CP
  //   CP
  //   CP
  //   CP
  //   CP
  //   CP
  //   来自uPC
  //   BUS
  //   BUS
  //   BUS
  //   BUS
  //   7
  //   BUS
  //   7
  //   7
  //   BUS
  //   BUS
  //   BUS
  //   7
  //   7
  //   7
  //   7
  //   7
  //   7
  //   7
  //   6
  //   6
  //   6
  //   6
  //   6
  //   6
  //   6
  //   6
  //   6
  //   6
  //   5
  //   5
  //   5
  //   5
  //   5
  //   5
  //   5
  //   5
  //   5
  //   4
  //   4
  //   4
  //   5
  //   4
  //   4
  //   4
  //   4
  //   4
  //   4
  //   4
  //   3
  //   3
  //   3
  //   3
  //   3
  //   3
  //   3
  //   3
  //   3
  //   3
  //   2
  //   2
  //   2
  //   2
  //   2
  //   2
  //   2
  //   2
  //   2
  //   2
  //   1
  //   1
  //   1
  //   1
  //   1
  //   1
  //   1
  //   1
  //   1
  //   1
  //   0
  //   0
  //   0
  //   0
  //   0
  //   0
  //   0
  //   0
  //   CONDITION R
  //   0
  //   0
  //   CPZ
  //   暂存ALU的值
  //   计算状态位，en控制能否输出（当CPR3有效时才能输出）
  //   控制单向传输数据
  //   0--CARRY_BITES
  //   不读的时候此线路接通
  //   1--ZERO_JUDGE
  //   C
  //   ---->
  //   P
  //   <<<<<<<<<<<<
  //   2--NEGITAVE_JUDGE
  //   M
  //   3--OVERFLOW_JUDGE
  //   B
  //   R
  //   寄存器组
  //   IR
  //   7
  //   MAR
  //   PC
  //   ALU
  //   clrn
  //   0
  //   S3S2S1S0=1001  M=0 C=0
  //   控制单向传输数据
  //   只有当读的时候此线路才能接通，将RAM的读出值送往MBR输入端
  //   ----------------------------------------------------------------------------------------------------------------------------------------------------------------------------------------------------------------------------------------------------------------------------------------------------------------------------
  //   ROM控制区域
  //   >>>>>>>>>>>
  //   0
  //   1
  //   2
  //   ZHONG SHANG
  //   3
  //   7
  //   0
  //   B选择器：A端口连OB，B端口连PC
  //   RD时有效
  //   A
  //   A选择器：A端口连OA，B端口连MBR
  //   P
  //   OB
  //   B
  //   M
  //   OA
  //   A
  //   C
  //   B
  //   B
  //   R
  //   A
  //   A：高八位 B：IR+0000
  //   高八位/IR+0000 选择器
  //   0
  //   0
  //   0
  //   1
  //   2
  //   3
  //   CPuPC
  //   加非门！！！
  //   YOU SHANG
  //   uPC
  //   A选择器的B0，即MBRA
  //   ZUOSHANG
  //   A选择器的B7
  //   WR
  //   ZHONG XIA
endmodule
